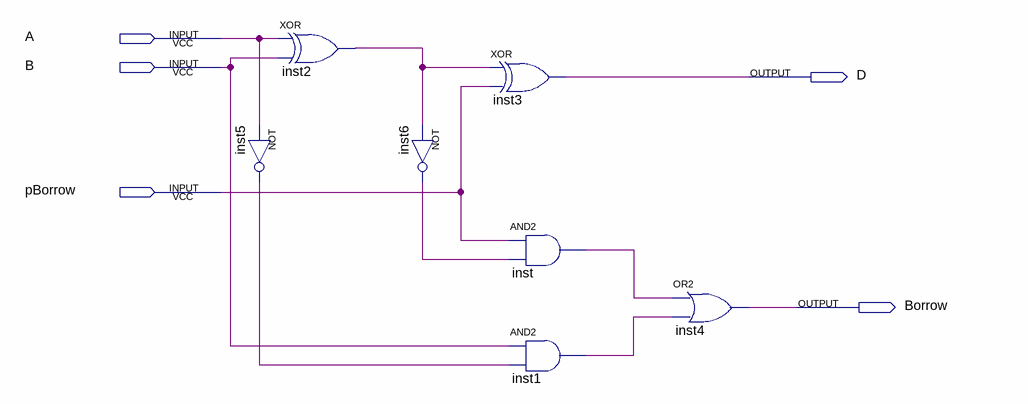
[diagram p0: schematic sheet]
// Quartus schematic FulSub.bdf as structural Verilog: 7 symbols, 5 pins
module FulSub (
  input  A,
  input  B,
  input  pBorrow,
  output D,
  output Borrow
);

  wire inst1_out, inst2_out, inst5_out, inst6_out, inst_out;

  xor inst2 (inst2_out, A, B);
  not inst5 (inst5_out, A);
  not inst6 (inst6_out, inst2_out);
  xor inst3 (D, inst2_out, pBorrow);
  and inst (inst_out, pBorrow, inst6_out);
  and inst1 (inst1_out, B, inst5_out);
  or inst4 (Borrow, inst_out, inst1_out);
endmodule
